# EAGLE design wio_shield_v2 (EAGLE 7.6.0)
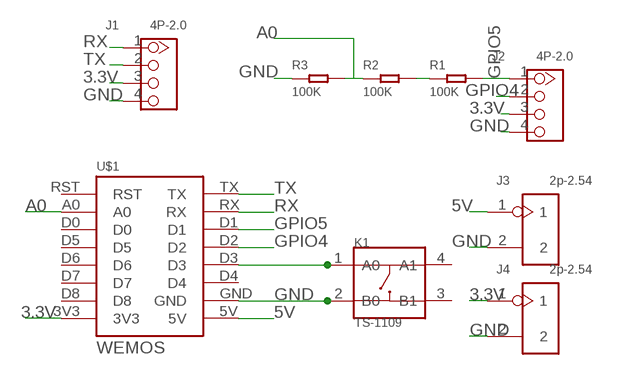
[diagram p0: schematic, sheet 1]

## Parts
J1  4P-2.0  GROVE-CONNECTOR-DIP(4P-2.0)  [HW4-2.0]
J2  4P-2.0  GROVE-CONNECTOR-DIP(4P-2.0)  [HW4-2.0]
J3  2p-2.54  DIP-BLUE-MALE-HEADER-VERT(2P-2.54)  [H2-2.54]
J4  2p-2.54  DIP-BLUE-MALE-HEADER-VERT(2P-2.54)  [H2-2.54]
K1  TS-1109  DIP-BUTTON-4P  [SW4-6.0X6.0X5.0MM]
R1  100K  DIP-RES-100K-5%-1/6W(PR-D1.8XL3.3MM)  [PR-D1.8*L3.3MM]
R2  100K  DIP-RES-100K-5%-1/6W(PR-D1.8XL3.3MM)  [PR-D1.8*L3.3MM]
R3  100K  DIP-RES-100K-5%-1/6W(PR-D1.8XL3.3MM)  [PR-D1.8*L3.3MM]
U$1  WEMOS  [WEMOS]

## Nets
3.3V: J1.3 J2.3 J4.1 U$1.3V3
5V: J3.1 U$1.5V
A0: R2.6 R3.5 U$1.A0
GND: J1.4 J2.4 J3.2 J4.2 K1.2(B0) R3.6 U$1.GND
GPIO4: J2.2 U$1.D2
GPIO5: J2.1 R1.5 U$1.D1
N$1: R1.6 R2.5
N$2: K1.1(A0) U$1.D3
RX: J1.1 U$1.RX
TX: J1.2 U$1.TX
Unconnected: K1.3(B1) K1.4(A1) U$1.D0 U$1.D4 U$1.D5 U$1.D6 U$1.D7 U$1.D8 U$1.RST

## Library data of the parts
J1 J2 = Seeed-Connector -2016:GROVE-CONNECTOR-DIP(4P-2.0): 320110033
J3 J4 = Seeed-OPL-Connector:DIP-BLUE-MALE-HEADER-VERT(2P-2.54): 320020015; MPN: P125-1102A0BS116A2
K1 = Seeed-OPL-Button:DIP-BUTTON-4P: 311020024; MPN: TS-1109
R1-R3 = Seeed-OPL-Resistor:DIP-RES-100K-5%-1/6W(PR-D1.8XL3.3MM): 301020040; MPN: FHCFR-1/6W-104J--
U$1 = 1455413453956-wemos:WEMOS

## Board
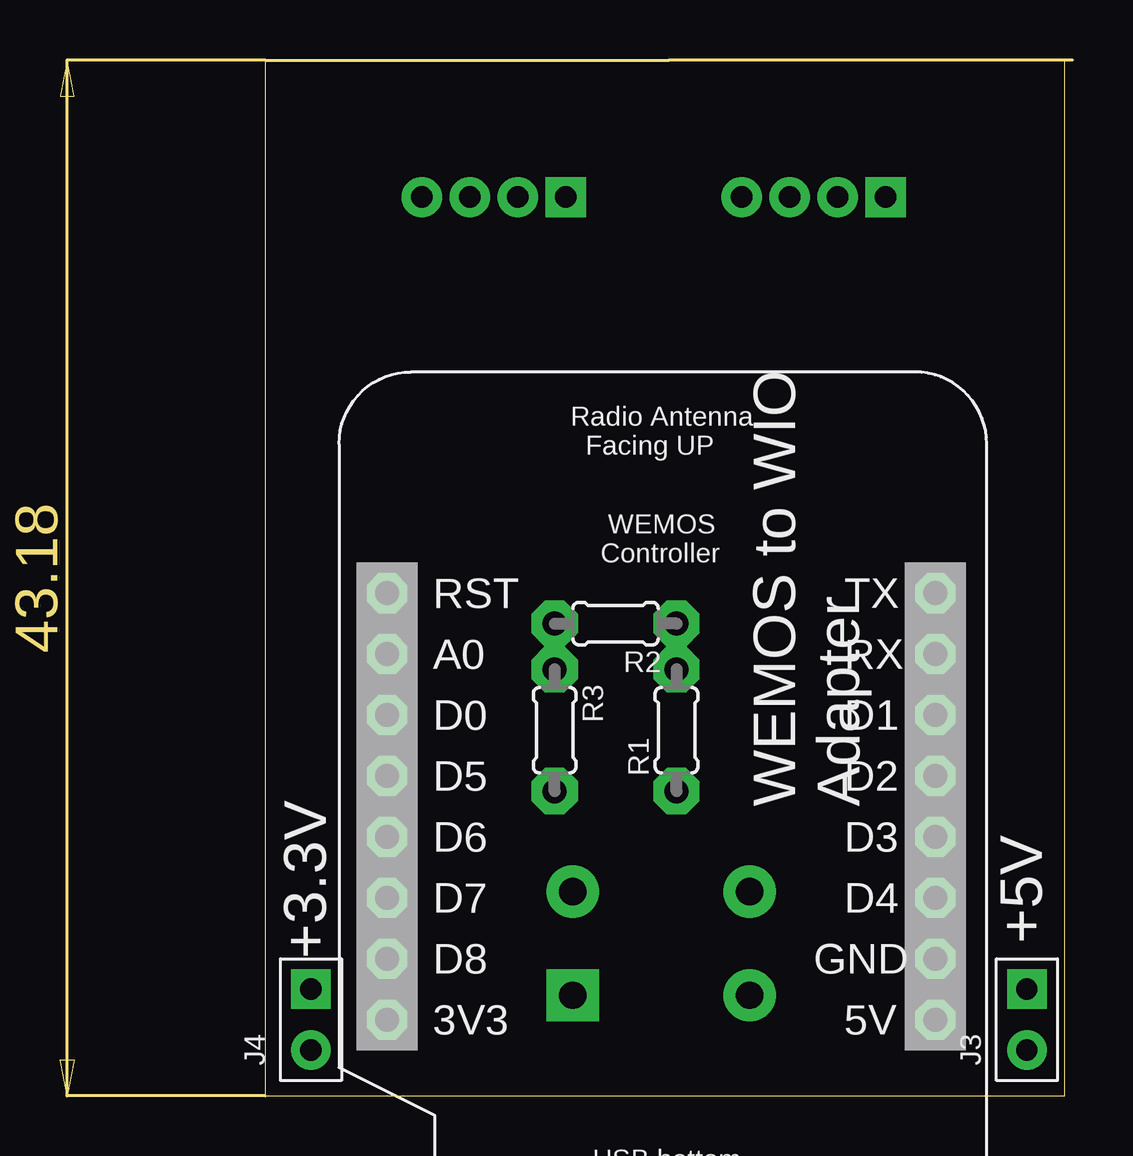
[diagram p1: board, top side]
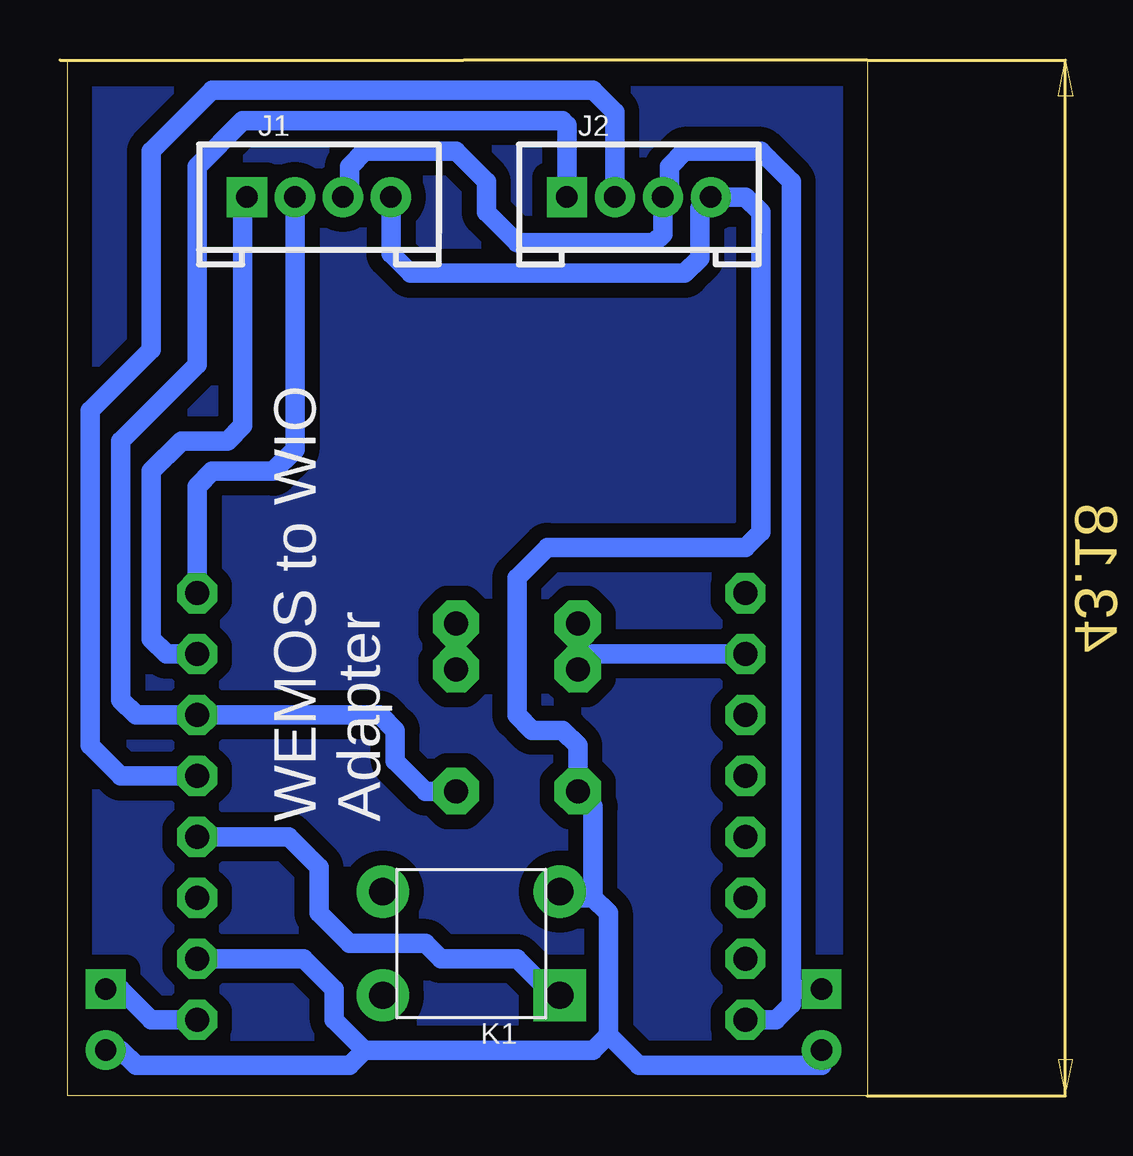
[diagram p2: board, bottom side, seen from below]

Size 33.33 x 43.17 mm. Coordinates in mm from the lower left corner, seen from the top.
Outline: 0,0 33.33,0 33.33,43.17 0,43.17 0,0
Copper layers (1*16): Top 0.035mm / dielectric 1.5mm / Bottom 0.035mm
Design rules "default": minimum track width 10mil, minimum drill 24mil, track to track 8mil, track to pad 8mil, pad to pad 8mil, via to via 8mil, smd to smd 8mil, copper to edge 40mil, drill to drill 8mil, minimum pad ring 10mil, minimum via ring 8mil, stop-mask expansion 4mil, vias tented up to drill 0mil, thermal gap 10mil

### Footprints (pad centres in the part's own frame; a part is rotated, then mirrored left to right if it is on the bottom)
HW4-2.0 = drill 0.9 pad 1.676 square: 1 -3,0 | drill 0.9 pad 1.676: 2 -1,0; 3 1,0; 4 3,0
H2-2.54 = drill 0.889 pad 1.651 square: 1 0,1.27 | drill 0.889 pad 1.651: 2 0,-1.27
SW4-6.0X6.0X5.0MM = drill 1.143 pad 2.184 square: 1 -3.683,2.159 | drill 1.143 pad 2.184: 2 -3.683,-2.159; 3 3.683,-2.159; 4 3.683,2.159
PR-D1.8*L3.3MM = drill 1 pad 1.93 octagon: 5 -2.54,0; 6 2.54,0
WEMOS = drill 1 pad 1.676 octagon: 3V3 0,0; 5V 22.86,0; A0 0,15.24; D0 0,12.7; D1 22.86,12.7; D2 22.86,10.16; D3 22.86,7.62; D4 22.86,5.08; D5 0,10.16; D6 0,7.62; D7 0,5.08; D8 0,2.54; GND 22.86,2.54; RST 0,17.78; RX 22.86,15.24; TX 22.86,17.78

### Placement (x,y rotation side)
J1  22.86,37.46 0 bottom
J2  9.52,37.46 0 bottom
J3  31.75,3.18 0 top
J4  1.91,3.18 0 top
K1  16.51,6.35 180 bottom
R1  17.14,15.24 90 top
R2  14.61,19.69 180 top
R3  12.06,15.24 270 top
U$1  5.08,3.18 0 top

### Tracks (layer width: path | path; a pad name or v marks a point on that pad's centre or on a via)
3.3V
  Bottom 0.813: J1.3 21.59,37.73 21.59,38.73 20.95,39.37 17.14,39.37 15.88,38.1 15.88,36.83 14.61,35.56 8.89,35.56 8.52,35.92 J2.3 8.25,37.73 8.25,38.73 7.62,39.37 4.44,39.37 3.17,38.1 3.17,4.45 | U$1.3V3 3.81,3.18 3.17,3.81 3.17,4.45 | J4.1 3.17,4.45
5V
  Bottom 0.813: J3.1 31.11,4.45 29.85,3.18 U$1.5V
A0
  Bottom 0.813: U$1.A0 11.43,18.41 R3.5 R2.6
GND
  Bottom 0.813: K1.2 12.45,8.51 | 11.43,8.26 11.68,8.51 12.45,8.51 | 11.43,8.26 10.79,7.62 10.79,2.54 | 10.79,2.54 11.43,1.9 20.95,1.9 | 20.95,1.9 22.22,3.18 22.22,4.45 23.49,5.72 U$1.GND | 12.45,8.51 12.7,8.26 11.43,8.26 | 11.43,8.26 11.43,12.06 R3.6 12.06,14.6 12.7,15.24 13.97,15.24 14.61,15.88 14.61,21.59 13.33,22.86 5.08,22.86 4.44,23.49 4.44,36.83 5.08,37.46 J2.4 6.99,37 6.99,34.92 7.62,34.29 19.05,34.29 19.86,35.1 J1.4 | J3.2 31.11,1.9 30.48,1.27 21.59,1.27 20.95,1.9 | J4.2 1.91,1.27 9.52,1.27 10.79,2.54
GPIO4
  Bottom 0.813: J2.2 10.52,41 11.43,41.91 27.3,41.91 29.85,39.37 29.85,31.11 32.39,28.57 32.39,14.6 31.11,13.33 U$1.D2
GPIO5
  Bottom 0.813: R1.5 18.41,12.7 19.68,13.97 19.68,15.24 20.32,15.88 U$1.D1 30.48,15.88 31.11,16.51 31.11,27.3 27.94,30.48 27.94,38.73 26.04,40.64 12.7,40.64 12.52,40.46 J2.1
N$1
  Bottom 0.813: R2.5 R1.6
N$2
  Bottom 0.813: K1.1 13.08,4.19 14.61,5.72 17.78,5.72 18.41,6.35 21.59,6.35 22.86,7.62 22.86,9.53 24.13,10.79 U$1.D3
N$3
  pour Bottom (isolate 0.61): 0,43.18 33.66,43.18 33.66,0 0,0
RX
  Bottom 0.813: J1.1 26.04,37.46 26.04,27.94 26.67,27.3 28.57,27.3 29.85,26.03 29.85,19.05 29.21,18.41 U$1.RX
TX
  Bottom 0.813: J1.2 23.86,26.94 24.76,26.03 27.3,26.03 27.94,25.4 U$1.TX

### Text on the board
tPlace: +3.3V
tNames: WEMOS to WIO / Adapter | +5V
bNames: WEMOS to WIO / Adapter